# Altium schematic sheet ETHERNET.SchDoc
size A2
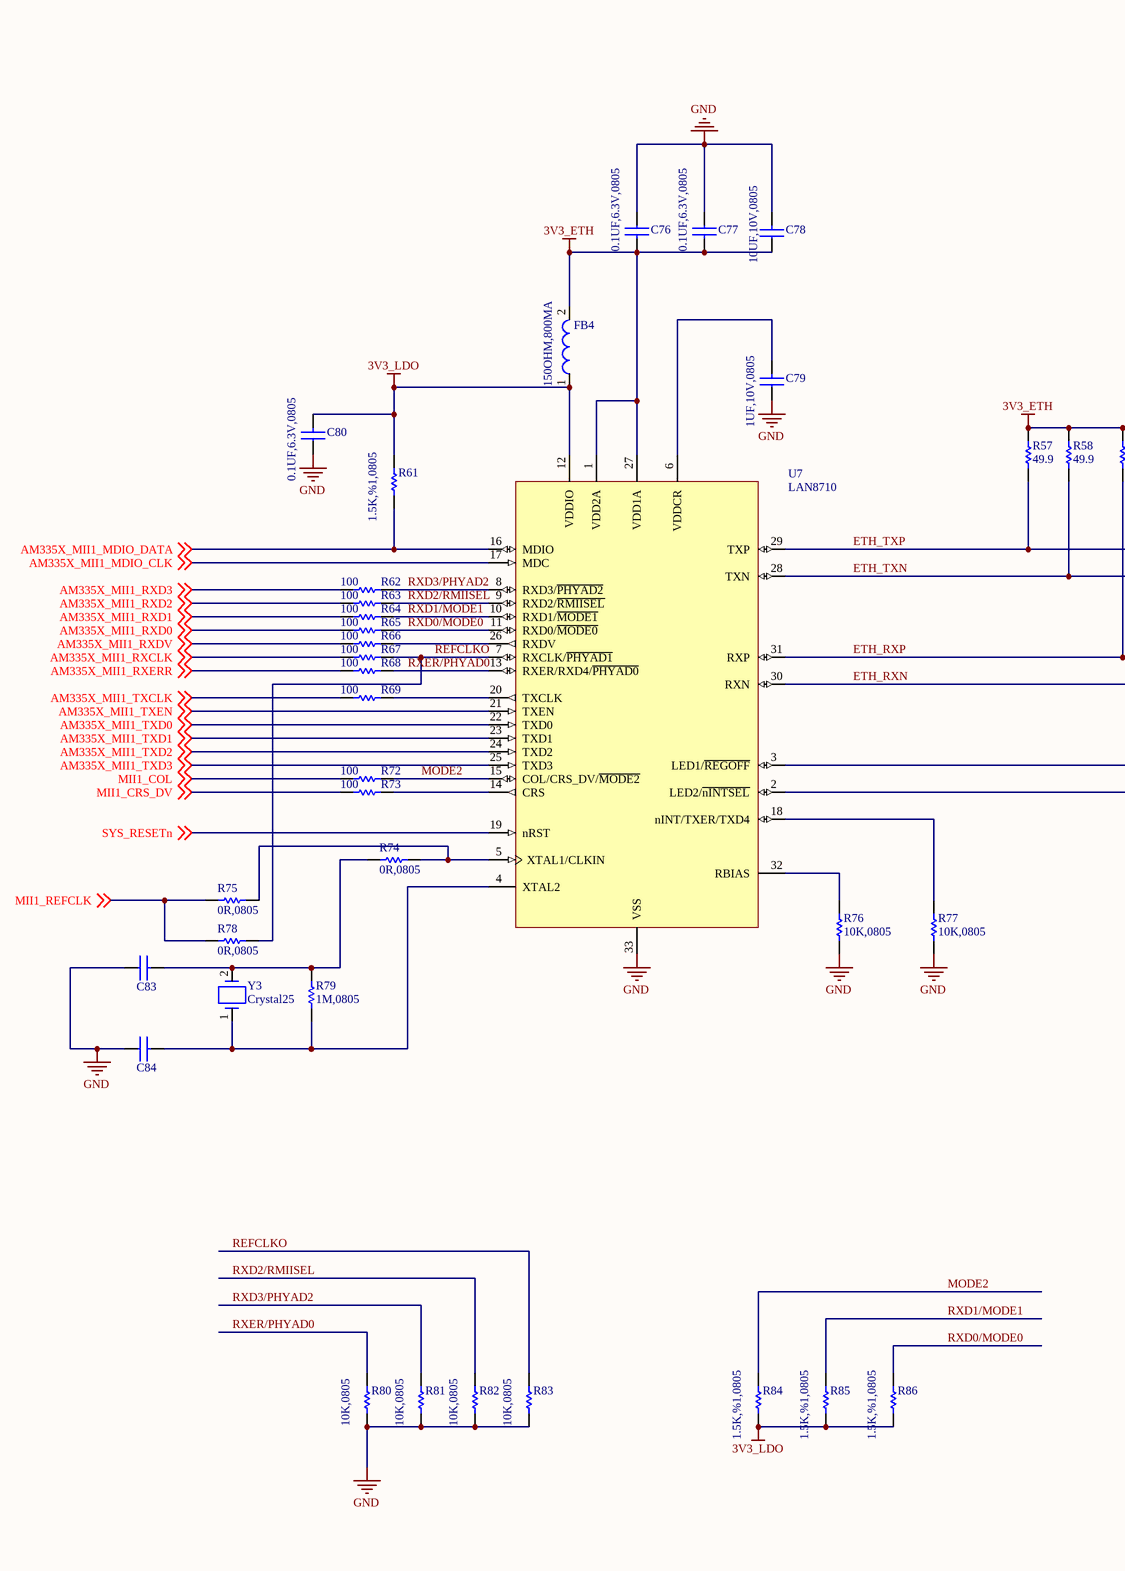
[diagram p0: ETHERNET.SchDoc, left]
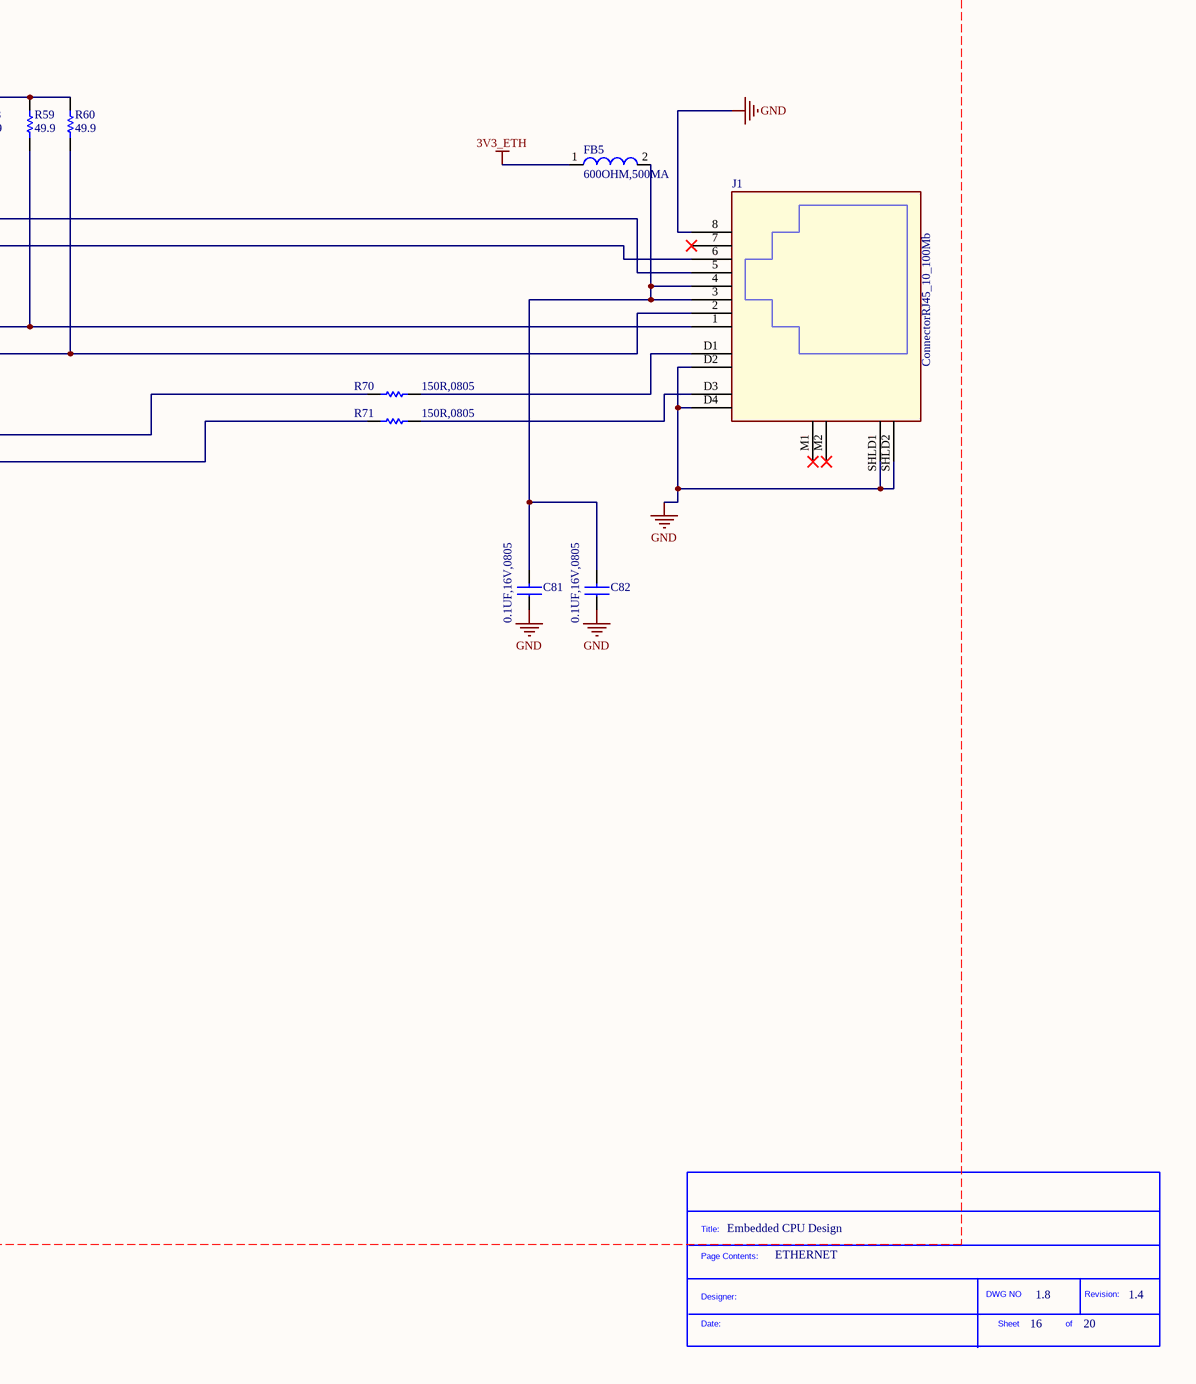
[diagram p1: ETHERNET.SchDoc, right]

## Parts
*?  SDTitleBlock  (value not drawn)  (graphical)
C76  0.1UF,6.3V,0805  [0805]
C77  0.1UF,6.3V,0805  [0805]
C78  10UF,10V,0805  [0805]
C79  1UF,10V,0805  [0805]
C80  0.1UF,6.3V,0805  [0805]
C81  0.1UF,16V,0805  [0805]
C82  0.1UF,16V,0805  [0805]
C83  18PF,50V,0805  [0805]  (value not drawn)
C84  18PF,50V,0805  [0805]  (value not drawn)
FB4  150OHM,800MA  [0805]
FB5  600OHM,500MA  [0805]
J1  ConnectorRJ45_10_100Mb  [6605728-1]
R57  49.9  [0402]
R58  49.9  [0402]
R59  49.9  [0402]
R60  49.9  [0402]
R61  1.5K,%1,0805  [0805]
R62  100  [0805]
R63  100  [0805]
R64  100  [0805]
R65  100  [0805]
R66  100  [0805]
R67  100  [0805]
R68  100  [0805]
R69  100  [0805]
R70  150R,0805  [0805]
R71  150R,0805  [0805]
R72  100  [0805]
R73  100  [0805]
R74  0R,0805  [0805]
R75  0R,0805  [0805]
R76  10K,0805  [0805]
R77  10K,0805  [0805]
R78  0R,0805  [0805]
R79  1M,0805  [0805]
R80  10K,0805  [0805]
R81  10K,0805  [0805]
R82  10K,0805  [0805]
R83  10K,0805  [0805]
R84  1.5K,%1,0805  [0805]
R85  1.5K,%1,0805  [0805]
R86  1.5K,%1,0805  [0805]
U7  LAN8710  [MCHP-QFN-32-5x5_V1]
Y3  Crystal25  [SM_OSC_ABM3]

## Nets
3V3_ETH: C76.2 C77.2 C78.1 FB4.2 FB5.1 R57.2 R58.2 R59.2 R60.2 U7.1(VDD2A) U7.27(VDD1A)
3V3_LDO: C80.2 FB4.1 R61.2 R84.1 R85.1 R86.1 U7.12(VDDIO)
GND: C76.1 C77.1 C78.2 C79.1 C80.1 C81.1 C82.1 C83.1 C84.1 J1.8 J1.D2 J1.D4 J1.SHLD1 J1.SHLD2 R76.1 R77.1 R80.1 R81.1 R82.1 R83.1 U7.33(VSS)
AM335X_MII1_MDIO_CLK: U7.17(MDC) ; off-sheet AM335X_MII1_MDIO_CLK
AM335X_MII1_MDIO_DATA: R61.1 U7.16(MDIO) ; off-sheet AM335X_MII1_MDIO_DATA
AM335X_MII1_RXCLK: R67.1 ; off-sheet AM335X_MII1_RXCLK
AM335X_MII1_RXD0: R65.1 ; off-sheet AM335X_MII1_RXD0
AM335X_MII1_RXD1: R64.1 ; off-sheet AM335X_MII1_RXD1
AM335X_MII1_RXD2: R63.1 ; off-sheet AM335X_MII1_RXD2
AM335X_MII1_RXD3: R62.1 ; off-sheet AM335X_MII1_RXD3
AM335X_MII1_RXDV: R66.1 ; off-sheet AM335X_MII1_RXDV
AM335X_MII1_RXERR: R68.1 ; off-sheet AM335X_MII1_RXERR
AM335X_MII1_TXCLK: R69.1 ; off-sheet AM335X_MII1_TXCLK
AM335X_MII1_TXD0: U7.22(TXD0) ; off-sheet AM335X_MII1_TXD0
AM335X_MII1_TXD1: U7.23(TXD1) ; off-sheet AM335X_MII1_TXD1
AM335X_MII1_TXD2: U7.24(TXD2) ; off-sheet AM335X_MII1_TXD2
AM335X_MII1_TXD3: U7.25(TXD3) ; off-sheet AM335X_MII1_TXD3
AM335X_MII1_TXEN: U7.21(TXEN) ; off-sheet AM335X_MII1_TXEN
ETH_RXN: J1.2 R60.1 U7.30(RXN)
ETH_RXP: J1.1 R59.1 U7.31(RXP)
ETH_TXN: J1.6 R58.1 U7.28(TXN)
ETH_TXP: J1.5 R57.1 U7.29(TXP)
MII1_COL: R72.1 ; off-sheet MII1_COL
MII1_CRS_DV: R73.1 ; off-sheet MII1_CRS_DV
MII1_REFCLK: R75.1 R78.1 ; off-sheet MII1_REFCLK
MODE2: R72.2 R84.2 U7.15(COL/CRS_DV/~{MODE2})
REFCLKO: R67.2 R78.2 R83.2 U7.7(RXCLK/~{PHYAD1})
RXD0/MODE0: R65.2 R86.2 U7.11(RXD0/~{MODE0})
RXD1/MODE1: R64.2 R85.2 U7.10(RXD1/~{MODE1})
RXD2/RMIISEL: R63.2 R82.2 U7.9(RXD2/~{RMIISEL})
RXD3/PHYAD2: R62.2 R81.2 U7.8(RXD3/~{PHYAD2})
RXER/PHYAD0: R68.2 R80.2 U7.13(RXER/RXD4/~{PHYAD0})
SYS_RESETn: U7.19(nRST) ; off-sheet SYS_RESETn
NetC79_2: C79.2 U7.6(VDDCR)
NetC81_2: C81.2 C82.2 FB5.2 J1.3 J1.4
NetC83_2: C83.2 R74.1 R79.2 Y3.2
NetC84_2: C84.2 R79.1 U7.4(XTAL2) Y3.1
NetJ1_D1: J1.D1 R70.1
NetJ1_D3: J1.D3 R71.1
NetR66_2: R66.2 U7.26(RXDV)
NetR69_2: R69.2 U7.20(TXCLK)
NetR70_2: R70.2 U7.3(LED1/~{REGOFF})
NetR71_2: R71.2 U7.2(LED2/~{nINTSEL})
NetR73_2: R73.2 U7.14(CRS)
NetR74_2: R74.2 R75.2 U7.5(XTAL1/CLKIN)
NetR76_2: R76.2 U7.32(RBIAS)
NetR77_2: R77.2 U7.18(nINT/TXER/TXD4)

Not connected (* = marked no-connect by the designer): J1 7* M1* M2*

## Layout directives
net class ETHERNET: 3V3_ETH, 3V3_LDO, AM335X_MII1_MDIO_CLK, AM335X_MII1_MDIO_DATA, AM335X_MII1_RXCLK, AM335X_MII1_RXD0, AM335X_MII1_RXD1, AM335X_MII1_RXD2, AM335X_MII1_RXD3, AM335X_MII1_RXDV, AM335X_MII1_RXERR, AM335X_MII1_TXCLK, AM335X_MII1_TXD0, AM335X_MII1_TXD1, AM335X_MII1_TXD2, AM335X_MII1_TXD3, AM335X_MII1_TXEN, ETH_RXN, ETH_RXP, ETH_TXN, ETH_TXP, GND, MII1_COL, MII1_CRS_DV, MII1_REFCLK, MODE2, REFCLKO, RXD0/MODE0, RXD1/MODE1, RXD2/RMIISEL, RXD3/PHYAD2, RXER/PHYAD0, SYS_RESETn

## Notes on the sheet
- Embedded CPU Design
- ETHERNET
- 16
- 1.8
- 20
- 1.4
- (in symbol SDTitleBlock) Title:; Page Contents:; DWG NO; Revision:; Designer:; Date:; Sheet; of

## Library data of the parts
C76 C77 C80 = 0.1UF,6.3V,0805: CAP CER 0.1UF 6.3V 10% X7R 0805; Manufacturer: Kemet; Manufacturer Part Number: C0805C104K9RACTU; Capacitance: 0.1µF; Supplier 1: Digi-Key; RoHS: RoHS Compliant; Category: Capacitors; Stock 1: 19204; Pricing 1: 1=0.12, 10=0.083, 25=0.062, 50=0.0476, 100=0.0392, 250=0.03304, 1000=0.02228 (USD); Packaging: Digi-Reel®; Tolerance: ±10%; Voltage - Rated: 6.3V; Temperature Coefficient: X7R; Mounting Type: Surface Mount, MLCC; Operating Temperature: -55°C ~ 125°C; Applications: General Purpose; Ratings: -; Package / Case: 0805 (2012 Metric); Size / Dimension: 0.079" L x 0.049" W (2.00mm x 1.25mm); Height - Seated (Max): -; Thickness (Max): 0.035" (0.88mm); Lead Spacing: -; Features: -; Lead Style: -; ComponentLink1URL: http://www.kemet.com/docfinder?Partnumber=C0805C104K9RACTU; ComponentLink1Description: http://www.kemet.com/docfinder?Partnumber=C0805C104K9RACTU; Supplier Part Number 1: 399-9155-6-ND
C78 = 10UF,10V,0805: Multilayer Ceramic Capacitors MLCC - SMD/SMT 10uF 10% 10Volts; Manufacturer: TDK; Manufacturer Part Number: C2012X7R1A106K125AC; Type: Multilayer Ceramic Chip Capacitor; Case Height: 1.25 mm; Case Length: 2 mm; Dielectric: X7R; Temperature Coefficient / Code: +/- 15 %; Supplier 1: Mouser; RoHS: RoHS Compliant; Category: Multilayer Ceramic Capacitors MLCC - SMD/SMT; Stock 1: 114858; Pricing 1: 1=0.609, 10=0.530, 100=0.195, 1000=0.171, 2000=0.126, 10000=0.116, 24000=0.111, 50000=0.104, 100000=0.097 (AUD); Capacitance: 10 uF; Operating Temperature Range: - 55 C to + 125 C; Package / Case: 0805 (2012 metric); Packaging: Reel; Product: General Type MLCCs; Termination Style: SMD/SMT; Tolerance: 10 %; Voltage Rating DC: 10 V; Brand: TDK; Case Code - in: 0805; Case Code - mm: 2012; Case Width: 1.25 mm; Maximum Operating Temperature: + 125 C; Minimum Operating Temperature: - 55 C; Standard Pack Qty: 2000; RoHS - Mouser: Y; Minimum Order Quantity: 1; Reeling: True; ComponentLink1URL: http://www.mouser.com/ds/2/400/mlcc_commercial_general_en-266370.pdf; ComponentLink1Description: http://www.mouser.com/ds/2/400/mlcc_commercial_general_en-266370.pdf; Supplier Part Number 1: 810-C2012X7R1A106K
C79 = 1UF,10V,0805: AVX - 0805ZC105JAT2A - CAP, MLCC, X7R, 1UF, 10V, 0805; Capacitance: 1; Capacitance Tolerance: ± 5%; Dielectric Characteristic: X7; Voltage Rating: 10; Ceramic Capacitor Case: 0805 [2012 Metric]; SVHC: No SVHC (16-Jun-2014); Capacitor Case Style: 0805 [2012 Metric]<!--FANDB--><div class="features-and-benefits-container"></div>; Tolerance: ±5%; Manufacturer: AVX; Manufacturer Part Number: 0805ZC105JAT2A; RoHS: YES; Product Range: -; Operating Temperature Min: -55; Operating Temperature Max: 125; Packaging: Cut Tape; MSL: MSL 1 - Unlimited; Capacitance Tolerance ±: ± 5%; ComponentLink1URL: http://www.farnell.com/datasheets/1679506.pdf; ComponentLink1Description: http://www.farnell.com/datasheets/1679506.pdf; Supplier 1: Digi-Key; Category: Capacitors; Stock 1: 13938; Pricing 1: 1=0.81, 10=0.689, 100=0.403, 250=0.338, 500=0.3055, 1000=0.2795 (USD); Voltage - Rated: 10V; Temperature Coefficient: X7R; Mounting Type: Surface Mount, MLCC; Operating Temperature: -55°C ~ 125°C; Applications: General Purpose; Ratings: -; Package / Case: 0805 (2012 Metric); Size / Dimension: 0.079" L x 0.049" W (2.01mm x 1.25mm); Height - Seated (Max): -; Thickness (Max): 0.055" (1.40mm); Lead Spacing: -; Features: -; Lead Style: -; ComponentLink2URL: http://www.avx.com/docs/Catalogs/cx7r.pdf; ComponentLink2Description: http://www.avx.com/docs/Catalogs/cx7r.pdf; Supplier Part Number 1: 478-6224-1-ND
C81 C82 = 0.1UF,16V,0805: AVX - 0805YC104KAT2A - CAP, MLCC, X7R, 100NF, 16V, 0805; Capacitance: 0.1; Capacitance Tolerance: ± 10%; Dielectric Characteristic: X7; Voltage Rating: 16; Ceramic Capacitor Case: 0805 [2012 Metric]; SVHC: No SVHC (16-Jun-2014); Capacitor Case Style: 0805 [2012 Metric]<!--FANDB--><div class="features-and-benefits-container"></div>; Tolerance: ±10%; Supplier 1: Digi-Key; Manufacturer: AVX; Manufacturer Part Number: 0805YC104KAT2A; RoHS: YES; Stock 1: 9101; Pricing 1: 1=0.29, 10=0.198, 100=0.1008, 250=0.0816, 500=0.072, 1000=0.0612 (USD); Product Range: -; Operating Temperature Min: -55; Operating Temperature Max: 125; Packaging: Cut Tape; MSL: MSL 1 - Unlimited; Capacitance Tolerance ±: ± 10%; ComponentLink1URL: http://www.farnell.com/datasheets/1679506.pdf; ComponentLink1Description: http://www.farnell.com/datasheets/1679506.pdf; Supplier Part Number 1: 478-7961-1-ND; Category: Capacitors; Voltage - Rated: 16V; Temperature Coefficient: X7R; Mounting Type: Surface Mount, MLCC; Operating Temperature: -55°C ~ 125°C; Applications: General Purpose; Ratings: -; Package / Case: 0805 (2012 Metric); Size / Dimension: 0.079" L x 0.049" W (2.00mm x 1.25mm); Height - Seated (Max): -; Thickness (Max): 0.037" (0.94mm); Lead Spacing: -; Features: -; Lead Style: -; ComponentLink2URL: http://www.avx.com/docs/Catalogs/cx7r.pdf; ComponentLink2Description: http://www.avx.com/docs/Catalogs/cx7r.pdf
C83 C84 = 18PF,50V,0805: MULTICOMP - MC0805N180J500CT - CAP, MLCC, C0G/NP0, 18PF, 50V,0805, REEL; Product Range: MULTICOMP - MC Series; Capacitance: 18; Capacitance Tolerance: ± 5%; Voltage Rating: 50; Ceramic Capacitor Case: 0805 [2012 Metric]; Capacitor Terminals: SMD; Reel Quantity: 4000; Tolerance: ±5%; Temperature Coefficient: C0G, NP0; Supplier 1: Digi-Key; Manufacturer: MULTICOMP; Manufacturer Part Number: MC0805N180J500CT; RoHS: YES; Pricing 1: 1=0.1, 10=0.048, 25=0.034, 50=0.026, 100=0.022, 250=0.018, 500=0.0154, 1000=0.012 (USD); Dielectric Characteristic: C0G / NP0; Operating Temperature Min: -55; Operating Temperature Max: 125; Packaging: Tape & Reel; MSL: -; Capacitance Tolerance ±: ± 5%; Capacitor Case Style: 0805 [2012 Metric]; ComponentLink1URL: http://www.farnell.com/datasheets/1792107.pdf; ComponentLink1Description: http://www.farnell.com/datasheets/1792107.pdf; Supplier Part Number 1: 709-1171-1-ND; Category: Capacitors; Stock 1: 33659; Voltage - Rated: 50V; Mounting Type: Surface Mount, MLCC; Operating Temperature: -55°C ~ 125°C; Applications: General Purpose; Ratings: -; Package / Case: 0805 (2012 Metric); Size / Dimension: 0.080" L x 0.050" W (2.03mm x 1.27mm); Height - Seated (Max): -; Thickness (Max): 0.050" (1.27mm); Lead Spacing: -; Features: -; Lead Style: -; ComponentLink2URL: http://www.johansondielectrics.com/images/stories/surface-mount/smt-mlc/JDI_Surface-Mount_2012-01.pdf; ComponentLink2Description: http://www.johansondielectrics.com/images/stories/surface-mount/smt-mlc/JDI_Surface-Mount_2012-01.pdf
FB4 = 150OHM,800MA: FERRITE 800MA 150 OHM 0805 SMD; Manufacturer: Laird-Signal Integrity Products; Manufacturer Part Number: LI0805H151R-10; Impedance @ Frequency: 150 Ohm @ 100MHz; DC Resistance (DCR): 150 mOhm Max; Filter Type: Differential Mode - Single; Supplier 1: Digi-Key; RoHS: RoHS Compliant; Category: Filters; Stock 1: 418596; Pricing 1: 1=0.1, 10=0.07, 25=0.064, 50=0.0574, 100=0.0421, 250=0.03064, 500=0.02808, 1000=0.02424 (USD); Packaging: Cut Tape (CT); Current Rating: 800mA; Package / Case: 0805 (2012 Metric); Mounting Type: Surface Mount; Height (Max): 0.043" (1.10mm); Size / Dimension: 0.079" L x 0.049" W (2.00mm x 1.25mm); ComponentLink1URL: http://www.lairdtech.com/WorkArea/linkit.aspx?LinkIdentifier=id&ItemID=4912; ComponentLink1Description: http://www.lairdtech.com/WorkArea/linkit.aspx?LinkIdentifier=id&ItemID=4912; Supplier Part Number 1: 240-2384-1-ND
FB5 = 600OHM,500MA: FERRITE CHIP 600 OHM 500MA 0603; Manufacturer: Murata Electronics North America; Manufacturer Part Number: BLM18AG601SN1D; Impedance @ Frequency: 600 Ohm @ 100MHz; DC Resistance (DCR): 380 mOhm Max; Filter Type: Differential Mode - Single; Supplier 1: Digi-Key; RoHS: RoHS Compliant; Category: Filters; Stock 1: 305151; Pricing 1: 1=0.1, 10=0.079, 50=0.0648, 100=0.0476, 250=0.0346, 500=0.0317, 1000=0.02738 (USD); Packaging: Digi-Reel®; Current Rating: 500mA; Package / Case: 0603 (1608 Metric); Mounting Type: Surface Mount; Height (Max): 0.037" (0.95mm); Size / Dimension: 0.063" L x 0.031" W (1.60mm x 0.80mm); ComponentLink1URL: http://search.murata.co.jp/Ceramy/image/img/PDF/ENG/L0110S0100BLM18A.pdf; ComponentLink1Description: http://search.murata.co.jp/Ceramy/image/img/PDF/ENG/L0110S0100BLM18A.pdf; Supplier Part Number 1: 490-1014-6-ND
J1 = ConnectorRJ45_10_100Mb: Connector MagRJ-45 Jack w/LED 10_100Mb; Mfr: Tyco; MfrNum: 5-6605728-1; TIIntPartnumber: 2J0020; Vendor: Digikey; Cost100: 8.45; Cost10K: 3.22; Descriptive_Text: Connector MagRJ-45 Jack w/LED 10_100Mb; PartName: ConnectorRJ45_10_100Mb; DescriptiveText: Connector MagRJ-45 Jack w/LED 10_100Mb; Supplier 1: Digi-Key; Supplier Part Number 1: 1419-1020-ND
R57-R60 = 49.9: PANASONIC - ERJP06F49R9V - RESISTOR, THICK FILM, 49.9 OHM, 0.5W, 1%; Product Range: PANASONIC - ERJ Series; Power Rating: 500; Resistor Case Style: 0805 [2012 Metric]; Temperature Coefficient: ± 100; Voltage Rating: 400; SVHC: No SVHC (16-Dec-2013; Power (Watts): 0.1W, 1/10W; Supplier 1: Digi-Key; Manufacturer: PANASONIC; Manufacturer Part Number: ERJP06F49R9V; RoHS: YES; Stock 1: 24718; Pricing 1: 1=0.63, 50=0.2494, 100=0.1924, 250=0.14964, 500=0.10546, 1000=0.07695 (USD); Resistance: 49.9; Resistance Tolerance: ± 1%; Resistor Element Material: Thick Film; Packaging: Cut Tape; MSL: -; ComponentLink1URL: http://www.farnell.com/datasheets/1801181.pdf; ComponentLink1Description: http://www.farnell.com/datasheets/1801181.pdf; ComponentLink2URL: http://www.farnell.com/datasheets/1718548.pdf; ComponentLink2Description: http://www.farnell.com/datasheets/1718548.pdf; Supplier Part Number 1: P49.9DACT-ND; Category: Resistors; Resistance (Ohms): 49.9; Tolerance: ±1%; Composition: Thick Film; Features: Automotive AEC-Q200; Operating Temperature: -55°C ~ 155°C; Package / Case: 0402 (1005 Metric); Supplier Device Package: 0402; Size / Dimension: 0.039" L x 0.020" W (1.00mm x 0.50mm); Height: 0.016" (0.40mm); Number of Terminations: 2; ComponentLink3URL: http://industrial.panasonic.com/www-cgi/jvcr13pz.cgi?E+PZ+3+AOA0002+ERJ2RKF49R9X+7+WW; ComponentLink3Description: http://industrial.panasonic.com/www-cgi/jvcr13pz.cgi?E+PZ+3+AOA0002+ERJ2RKF49R9X+7+WW; ComponentLink4URL: http://industrial.panasonic.com/www-cgi/jvcr13pz.cgi?E+PZ+3+AOA0026+ERA6AEB49R9V+7+WW; ComponentLink4Description: http://industrial.panasonic.com/www-cgi/jvcr13pz.cgi?E+PZ+3+AOA0026+ERA6AEB49R9V+7+WW
R61 R84-R86 = 1.5K,%1,0805: MULTICOMP - MCPWR05FTEW1501 - RESISTOR, 0805, 1.5K 1%,  0.125W; Product Range: MULTICOMP - MCPWR Series; Resistance: 1.5; Power Rating: 125; Resistor Case Style: 0805 [2012 Metric]; Resistor Element Material: Thick Film; Temperature Coefficient: ± 100; Voltage Rating: 150; SVHC: No SVHC (16-Jun-2014); Resistor Mounting: SMD<!--FANDB--><div class="features-and-benefits-container"></div>; Power (Watts): 0.125W, 1/8W; Manufacturer: MULTICOMP; Manufacturer Part Number: MCPWR05FTEW1501; RoHS: Y-EX; Resistance Tolerance: ± 1%; Packaging: Cut Tape; MSL: -; ComponentLink1URL: http://www.farnell.com/datasheets/1718729.pdf; ComponentLink1Description: http://www.farnell.com/datasheets/1718729.pdf; ComponentLink2URL: http://www.farnell.com/cad/1638340.zip; ComponentLink2Description: http://www.farnell.com/cad/1638340.zip; Supplier 1: Digi-Key; Category: Resistors; Stock 1: 277366; Pricing 1: 1=0.1, 50=0.0288, 100=0.0219, 250=0.01624, 500=0.012, 1000=0.008, 2500=0.00675 (USD); Resistance (Ohms): 1.5k; Tolerance: ±1%; Composition: Thick Film; Features: Automotive AEC-Q200; Operating Temperature: -55°C ~ 155°C; Package / Case: 0805 (2012 Metric); Supplier Device Package: 0805; Size / Dimension: 0.079" L x 0.049" W (2.00mm x 1.25mm); Height: 0.028" (0.70mm); Number of Terminations: 2; ComponentLink3URL: http://industrial.panasonic.com/www-cgi/jvcr13pz.cgi?E+PZ+3+AOA0002+ERJ6ENF1501V+7+WW; ComponentLink3Description: http://industrial.panasonic.com/www-cgi/jvcr13pz.cgi?E+PZ+3+AOA0002+ERJ6ENF1501V+7+WW; Supplier Part Number 1: P1.50KCCT-ND
R62-R69 R72 R73 = 100: RES 100 OHM 1/8W 1% 0805 SMD; Manufacturer: Rohm Semiconductor; Manufacturer Part Number: MCR10ERTF1000; Power (Watts): 0.125W, 1/8W; Temperature Coefficient: ±100ppm/°C; Supplier 1: Digi-Key; RoHS: RoHS Compliant; Category: Resistors; Stock 1: 27803; Pricing 1: 1=0.1, 10=0.027, 25=0.0196, 100=0.0109, 250=0.00832, 500=0.00666, 1000=0.0049 (USD); Packaging: Cut Tape (CT); Resistance (Ohms): 100; Tolerance: ±1%; Composition: Thick Film; Features: -; Package / Case: 0805 (2012 Metric); Supplier Device Package: 0805 (2012 Metric); Size / Dimension: 0.079" L x 0.049" W (2.00mm x 1.25mm); Height: 0.024" (0.60mm); Number of Terminations: 2; ComponentLink1URL: http://rohmfs.rohm.com/en/products/databook/datasheet/passive/resistor/chip_resistor/mcr_g.pdf; ComponentLink1Description: http://rohmfs.rohm.com/en/products/databook/datasheet/passive/resistor/chip_resistor/mcr_g.pdf; Supplier Part Number 1: RHM100CHCT-ND
R70 R71 = 150R,0805: TE CONNECTIVITY / NEOHM - CPF0805B150RE1 - RESISTOR, 0805, 150R; Product Range: TE CONNECTIVITY - CPF Series; Resistance: 150; Power Rating: 100; Resistance Tolerance: ± 0.1%; Resistor Case Style: 0805 [2012 Metric]; Resistor Element Material: Thin Film; Temperature Coefficient: ± 25; Voltage Rating: 200; External Depth: 0.5; External Length / Height: 2; External Width: 1.25; Resistor Mounting: SMD; Tolerance: ±5%; Power (Watts): 0.125W, 1/8W; Supplier 1: Digi-Key; Manufacturer: TE CONNECTIVITY / NEOHM; Manufacturer Part Number: CPF0805B150RE1; RoHS: YES; Stock 1: 143875; Pricing 1: 1=0.1, 10=0.021, 50=0.0116, 100=0.0088, 250=0.00652, 500=0.0048, 1000=0.0032, 2500=0.0027 (USD); Packaging: Cut Tape; MSL: -; No. of Pins: 2; Operating Temperature Max: 155; Operating Temperature Min: -55; Operating Temperature Range: -55°C to +155; Series: CPF<!--FANDB--><div class="features-and-benefits-container"></div>; ComponentLink1URL: http://www.tycoelectronics.com/commerce/DocumentDelivery/DDEController?Action=srchrtrv&DocNm=1614884&DocType=Customer+Drawing&DocLang=English; ComponentLink1Description: http://www.tycoelectronics.com/commerce/DocumentDelivery/DDEController?Action=srchrtrv&DocNm=1614884&DocType=Customer+Drawing&DocLang=English; ComponentLink2URL: http://www.tycoelectronics.com/commerce/DocumentDelivery/DDEController?Action=srchrtrv&DocNm=1773200&DocType=Data+Sheet&DocLang=English; ComponentLink2Description: http://www.tycoelectronics.com/commerce/DocumentDelivery/DDEController?Action=srchrtrv&DocNm=1773200&DocType=Data+Sheet&DocLang=English; Supplier Part Number 1: RMCF0805JT150RCT-ND; Category: Resistors; Resistance (Ohms): 150; Composition: Thick Film; Features: -; Operating Temperature: -55°C ~ 155°C; Package / Case: 0805 (2012 Metric); Supplier Device Package: 0805; Size / Dimension: 0.079" L x 0.049" W (2.00mm x 1.25mm); Height: 0.026" (0.65mm); Number of Terminations: 2; ComponentLink3URL: http://www.seielect.com/Catalog/SEI-RMCF_RMCP.pdf; ComponentLink3Description: http://www.seielect.com/Catalog/SEI-RMCF_RMCP.pdf
R74 R75 R78 = 0R,0805: BOURNS - CR0805-J/-000ELF - RESISTOR, 0805, 0R, 5%, 1/8W; Product Range: BOURNS - CR Series; Resistance: 0; Power Rating: 125; Resistor Case Style: 0805 [2012 Metric]; Resistor Element Material: Thick Film; Temperature Coefficient: -250ppm/°C to +500; Voltage Rating: 150; SVHC: No SVHC (16-Jun-2014); Resistor Mounting: SMD<!--FANDB--><div class="features-and-benefits-container"></div>; Connector Type: RJ45; Number of Ports: 1; LED Color: Green - Yellow; Number of Cores per Jack: 6; Shielding: Shielded, EMI Finger; Tab Direction: Up; Shield Material: Brass; Resistance (Ohms): 0.0; Tolerance: Jumper; Power (Watts): 0.125W, 1/8W; Supplier 1: Digi-Key; Manufacturer: BOURNS; Manufacturer Part Number: CR0805-J/-000ELF; RoHS: YES; Stock 1: 1539206; Pricing 1: 1=0.1, 50=0.0196, 100=0.0149, 250=0.01104, 500=0.00816, 1000=0.00544, 2500=0.00459 (USD); Resistance Tolerance: ± 5%; Packaging: Cut Tape; MSL: MSL 1 - Unlimited; ComponentLink1URL: http://www.farnell.com/datasheets/1845293.pdf; ComponentLink1Description: http://www.farnell.com/datasheets/1845293.pdf; Supplier Part Number 1: P0.0ACT-ND; Category: Connectors, Interconnects; Number of Rows: 1; Applications: 10/100 Base-T, AutoMDIX; Mounting Type: Through Hole; Orientation: 90° Angle (Right); Termination: Solder; Height Above Board: 0.555" (14.10mm); Features: Board Lock, Decoupling Capacitance; Contact Material: Phosphor Bronze; Contact Finish: Gold; Contact Finish Thickness: 50µin (1.27µm); Housing Material: Polyethylene Terephthalate (PET), Polyester; Operating Temperature: 0°C ~ 70°C; ComponentLink2URL: http://www.trpconnector.com/pdfs/6605728.pdf; ComponentLink2Description: http://www.trpconnector.com/pdfs/6605728.pdf; Composition: Thick Film; Package / Case: 0805 (2012 Metric); Supplier Device Package: 0805; Size / Dimension: 0.079" L x 0.049" W (2.00mm x 1.25mm); Height: 0.028" (0.70mm); Number of Terminations: 2; ComponentLink3URL: http://industrial.panasonic.com/www-cgi/jvcr13pz.cgi?E+PZ+3+AOA0001+ERJ6GEY0R00V+7+WW; ComponentLink3Description: http://industrial.panasonic.com/www-cgi/jvcr13pz.cgi?E+PZ+3+AOA0001+ERJ6GEY0R00V+7+WW
R76 R77 R80-R83 = 10K,0805: BOURNS - CR0805-FX-1002GLF - RESISTOR, 10K, 0.125W, 1%; Product Range: BOURNS - CR Series; Resistance: 10; Power Rating: 125; Resistor Case Style: 0805 [2012 Metric]; Resistor Element Material: Thick Film; Temperature Coefficient: ± 100; Voltage Rating: 150; SVHC: No SVHC (16-Jun-2014); Resistor Mounting: SMD<!--FANDB--><div class="features-and-benefits-container"></div>; Power (Watts): 0.125W, 1/8W; Manufacturer: BOURNS; Manufacturer Part Number: CR0805-FX-1002GLF; RoHS: YES; Resistance Tolerance: ± 1%; Packaging: Cut Tape; MSL: MSL 1 - Unlimited; ComponentLink1URL: http://www.farnell.com/datasheets/1845293.pdf; ComponentLink1Description: http://www.farnell.com/datasheets/1845293.pdf; Supplier 1: Digi-Key; Category: Resistors; Stock 1: 1116166; Pricing 1: 1=0.1, 10=0.029, 50=0.0162, 100=0.0123, 250=0.00912, 500=0.00672, 1000=0.00448, 2500=0.00378 (USD); Resistance (Ohms): 10k; Tolerance: ±1%; Composition: Thick Film; Features: -; Operating Temperature: -55°C ~ 155°C; Package / Case: 0805 (2012 Metric); Supplier Device Package: 0805; Size / Dimension: 0.079" L x 0.049" W (2.00mm x 1.25mm); Height: 0.026" (0.65mm); Number of Terminations: 2; ComponentLink2URL: http://www.seielect.com/Catalog/SEI-RMCF_RMCP.pdf; ComponentLink2Description: http://www.seielect.com/Catalog/SEI-RMCF_RMCP.pdf; Supplier Part Number 1: RMCF0805FT10K0CT-ND
R79 = 1M,0805: MULTICOMP - MC0805S8F1004T5E - RESISTOR, THICK FILM, 1MOHM, 125mW, 1%; Product Range: MULTICOMP - MC Series; Resistance: 1; Power Rating: 125; Resistor Case Style: 0805 ^2012 Metric]; Power (Watts): 0.125W, 1/8W; Temperature Coefficient: ±100ppm/°C; Supplier 1: Digi-Key; Manufacturer: MULTICOMP; Manufacturer Part Number: MC0805S8F1004T5E; RoHS: Y-EX; Stock 1: 548421; Pricing 1: 1=0.1, 50=0.0288, 100=0.0219, 250=0.01624, 500=0.012, 1000=0.008, 2500=0.00675 (USD); Resistance Tolerance: ± 1%; Resistor Element Type: Thick Film; MSL: -; ComponentLink1URL: http://www.newark.com/pdfs/datasheets/spc/TA-677.pdf; ComponentLink1Description: http://www.newark.com/pdfs/datasheets/spc/TA-677.pdf; Supplier Part Number 1: P1.00MCCT-ND; Category: Resistors; Packaging: Cut Tape (CT); Resistance (Ohms): 1M; Tolerance: ±1%; Composition: Thick Film; Features: Automotive AEC-Q200; Operating Temperature: -55°C ~ 155°C; Package / Case: 0805 (2012 Metric); Supplier Device Package: 0805; Size / Dimension: 0.079" L x 0.049" W (2.00mm x 1.25mm); Height: 0.028" (0.70mm); Number of Terminations: 2; ComponentLink2URL: http://industrial.panasonic.com/www-cgi/jvcr13pz.cgi?E+PZ+3+AOA0002+ERJ6ENF1004V+7+WW; ComponentLink2Description: http://industrial.panasonic.com/www-cgi/jvcr13pz.cgi?E+PZ+3+AOA0002+ERJ6ENF1004V+7+WW
U7 = LAN8710A-QFN-32: Manufacturer: Microchip Technology; Manufacturer Part Number: LAN8710AI-EZK; Ethernet Connection Type: 10/100 Base-T; Standard Supported: 802.3, 802.3u; Supply Voltage - Max: 3.6 V; Supply Voltage - Min: 1.6 V; Supplier 1: Mouser; RoHS: RoHS Compliant; Category: Ethernet ICs; Stock 1: 10327; Pricing 1: 1=2.35, 10=2.03, 25=1.69, 100=1.54 (AUD); Package / Case: QFN-32; Packaging: Tray; Product: Ethernet Transceivers; Type: Single Chip PHY Transceiver; Brand: Microchip Technology; Mounting Style: SMD/SMT; Maximum Operating Temperature: + 85 C; Minimum Operating Temperature: - 40 C; Product Category: Ethernet Controllers; Standard Pack Qty: 490; RoHS - Mouser: Y; Minimum Order Quantity: 1; Reeling: False; ComponentLink1URL: http://www.mouser.com/ds/2/268/8710a-320908.pdf; ComponentLink1Description: http://www.mouser.com/ds/2/268/8710a-320908.pdf; Supplier Part Number 1: 886-LAN8710AI-EZK
Y3 = Crystal25MHzABM3: Crystal 25MHz; TIIntPartnumber: 1Y0030; MfrNum: ABM3-25.000MHz-B2-T; Mfr: Abracon; Manufacturer: Abracon Corporation; Cost10K: 0.51; Cost100: 0.90; Vendor: Digikey; TN: tbd; Frequency Stability: ±50ppm; Frequency Tolerance: ±20ppm; Load Capacitance: 18pF; ESR (Equivalent Series Resistance): 30 Ohm; Operating Mode: Fundamental; Descriptive_Text: Crystal 25MHz; PartName: Crystal25MHzABM3; DescriptiveText: Crystal 25MHz; Supplier 1: Digi-Key; Supplier Part Number 1: 535-9108-1-ND; Manufacturer Part Number: ABM3-25.000MHZ-B2-T; RoHS: RoHS Compliant; Category: Crystals and Oscillators; Stock 1: 10200; Pricing 1: 1=1.04, 10=0.92, 50=0.8588, 100=0.76, 500=0.7182 (USD); Packaging: Cut Tape (CT); Type: MHz Crystal; Frequency: 25MHz; Operating Temperature: -20°C ~ 70°C; Ratings: -; Mounting Type: Surface Mount; Package / Case: 2-SMD; Size / Dimension: 0.197" L x 0.126" W (5.00mm x 3.20mm); Height: 0.051" (1.30mm); ComponentLink1URL: http://www.abracon.com/Resonators/abm3.pdf; ComponentLink1Description: http://www.abracon.com/Resonators/abm3.pdf